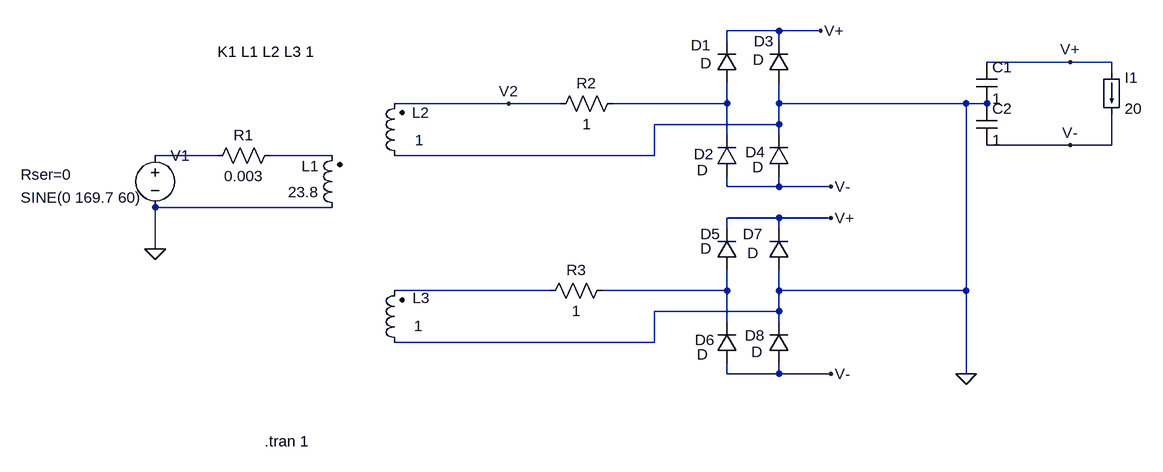
[diagram p0: schematic psu_parasitics.asc]
psu_parasitics.asc, the LTspice schematic file:
Version 4
SHEET 1 2164 680
WIRE 736 -32 656 -32
WIRE 800 -32 736 -32
WIRE 656 -16 656 -32
WIRE 736 -16 736 -32
WIRE 1184 16 1056 16
WIRE 1248 16 1184 16
WIRE 1248 32 1248 16
WIRE 320 80 144 80
WIRE 400 80 320 80
WIRE 656 80 656 48
WIRE 656 80 480 80
WIRE 736 80 736 48
WIRE 1024 80 736 80
WIRE 1056 80 1024 80
WIRE 736 112 736 80
WIRE 736 112 544 112
WIRE 656 128 656 80
WIRE 736 128 736 112
WIRE 1184 144 1056 144
WIRE 1248 144 1248 96
WIRE 1248 144 1184 144
WIRE -128 160 -224 160
WIRE 48 160 -48 160
WIRE 544 160 544 112
WIRE 544 160 144 160
WIRE 656 208 656 192
WIRE 736 208 736 192
WIRE 736 208 656 208
WIRE 816 208 736 208
WIRE 48 240 -224 240
WIRE 736 256 656 256
WIRE 816 256 736 256
WIRE 656 272 656 256
WIRE 736 272 736 256
WIRE -224 304 -224 240
WIRE 384 368 144 368
WIRE 656 368 656 336
WIRE 656 368 464 368
WIRE 736 368 736 336
WIRE 1024 368 1024 80
WIRE 1024 368 736 368
WIRE 736 400 736 368
WIRE 736 400 544 400
WIRE 656 416 656 368
WIRE 736 416 736 400
WIRE 544 448 544 400
WIRE 544 448 144 448
WIRE 656 496 656 480
WIRE 736 496 736 480
WIRE 736 496 656 496
WIRE 816 496 736 496
WIRE 1024 496 1024 368
FLAG -224 304 0
FLAG 1024 496 0
FLAG 1184 16 V+
FLAG 1184 144 V-
FLAG 800 -32 V+
FLAG 816 208 V-
FLAG 816 256 V+
FLAG 816 496 V-
FLAG 320 80 V2
SYMBOL ind2 64 256 R180
WINDOW 0 36 80 Left 2
WINDOW 3 36 40 Left 2
SYMATTR InstName L1
SYMATTR Value 23.8
SYMATTR Type ind
SYMATTR SpiceLine Rser=0.34
SYMBOL ind2 160 176 R180
WINDOW 0 -38 82 Left 2
WINDOW 3 -29 40 Left 2
SYMATTR InstName L2
SYMATTR Value 1
SYMATTR Type ind
SYMATTR SpiceLine Rser=0.04
SYMBOL voltage -224 144 R0
WINDOW 3 -207 81 Left 2
WINDOW 123 24 180 Left 2
WINDOW 39 -207 45 Left 2
SYMATTR Value SINE(0 169.7 60)
SYMATTR SpiceLine Rser=0
SYMATTR InstName V1
SYMBOL ind2 160 464 R180
WINDOW 0 -39 85 Left 2
WINDOW 3 -28 42 Left 2
SYMATTR InstName L3
SYMATTR Value 1
SYMATTR Type ind
SYMATTR SpiceLine Rser=0.04
SYMBOL diode 672 48 R180
WINDOW 0 41 58 Left 2
WINDOW 3 40 30 Left 2
SYMATTR InstName D1
SYMBOL diode 672 192 R180
WINDOW 0 36 34 Left 2
WINDOW 3 45 10 Left 2
SYMATTR InstName D2
SYMBOL diode 752 48 R180
WINDOW 0 24 64 Left 2
WINDOW 3 39 36 Left 2
SYMATTR InstName D3
SYMBOL diode 752 192 R180
WINDOW 0 37 37 Left 2
WINDOW 3 40 14 Left 2
SYMATTR InstName D4
SYMBOL diode 672 336 R180
WINDOW 0 26 55 Left 2
WINDOW 3 40 33 Left 2
SYMATTR InstName D5
SYMBOL diode 672 480 R180
WINDOW 0 35 36 Left 2
WINDOW 3 45 14 Left 2
SYMATTR InstName D6
SYMBOL diode 752 336 R180
WINDOW 0 41 55 Left 2
WINDOW 3 47 26 Left 2
SYMATTR InstName D7
SYMBOL diode 752 480 R180
WINDOW 0 38 43 Left 2
WINDOW 3 41 18 Left 2
SYMATTR InstName D8
SYMBOL cap 1040 16 R0
SYMATTR InstName C1
SYMATTR Value 1
SYMBOL cap 1040 80 R0
SYMATTR InstName C2
SYMATTR Value 1
SYMBOL load 1232 32 R0
WINDOW 123 0 0 Left 2
WINDOW 39 0 0 Left 2
SYMATTR InstName I1
SYMATTR Value 20
SYMBOL res -32 144 R90
WINDOW 0 0 56 VBottom 2
WINDOW 3 32 56 VTop 2
SYMATTR InstName R1
SYMATTR Value 0.003
SYMBOL res 496 64 R90
WINDOW 0 0 56 VBottom 2
WINDOW 3 32 56 VTop 2
SYMATTR InstName R2
SYMATTR Value 1
SYMBOL res 480 352 R90
WINDOW 0 0 56 VBottom 2
WINDOW 3 32 56 VTop 2
SYMATTR InstName R3
SYMATTR Value 1
TEXT -128 0 Left 2 !K1 L1 L2 L3 1
TEXT -56 600 Left 2 !.tran 1

The netlist it stands for:
* psu_parasitics.asc
L1 0 N003 23.8 Rser=0.34
L2 0 V2 1 Rser=0.04
V1 N002 0 SINE(0 169.7 60) Rser=0
L3 0 N004 1 Rser=0.04
D1 N001 V+ D
D2 V- N001 D
D3 0 V+ D
D4 V- 0 D
D5 N005 V+ D
D6 V- N005 D
D7 0 V+ D
D8 V- 0 D
C1 V+ 0 1
C2 0 V- 1
I1 V+ V- 20
R1 N003 N002 0.003
R2 N001 V2 1
R3 N005 N004 1
.model D D
.lib standard.dio
K1 L1 L2 L3 1
.tran 1
.backanno
.end